# EAGLE design Blinky (EAGLE 8.2.1)
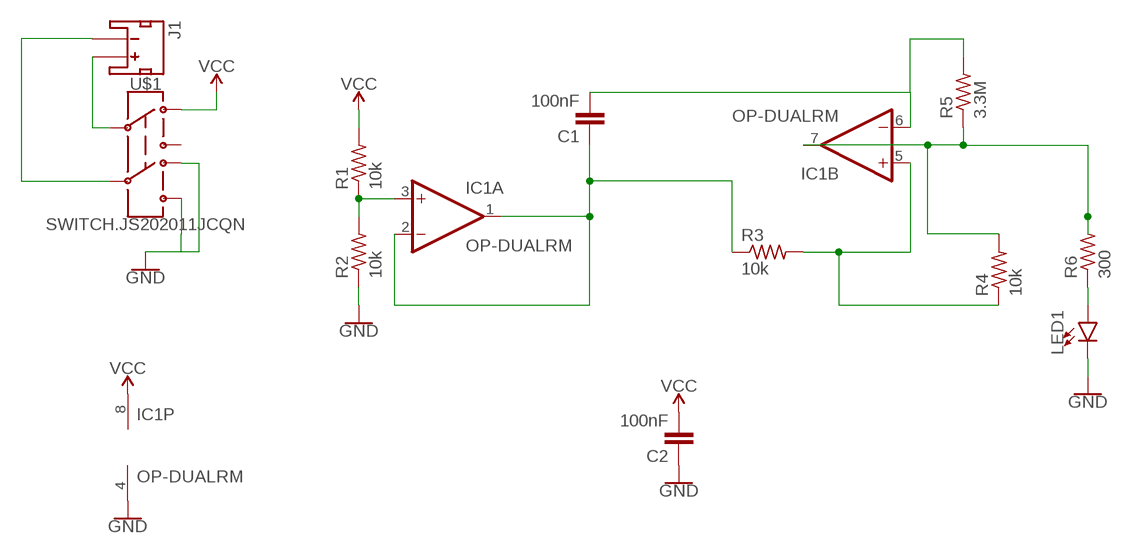
[diagram p0: schematic, sheet 1]

## Parts
C1  100nF  CAPACITOR0402  [C0402]
C2  100nF  CAPACITOR0402  [C0402]
IC1  OP-DUALRM  [MSOP08]
J1  JST_2MM_MALE  [JST-2-SMD]
LED1  LED0603  [LED-0603]
R1  10k  RESISTOR0402  [R0402]
R2  10k  RESISTOR0402  [R0402]
R3  10k  RESISTOR0402  [R0402]
R4  10k  RESISTOR0402  [R0402]
R5  3.3M  RESISTOR0402  [R0402]
R6  300  RESISTOR0402  [R0402]
U$1  SWITCH.JS202011JCQN  [SWITCH.00]

## Nets
GND: C2.1 IC1.4(P:V-) LED1.C R2.1 U$1.5 U$1.7
N$1: J1.1(-) U$1.6
N$2: J1.2(+) U$1.2
N$3: C1.1 IC1.1(A:OUT) IC1.2(A:-IN) R3.1
N$4: IC1.5(B:+IN) R3.2 R4.1
N$5: C1.2 IC1.6(B:-IN) R5.2
N$6: IC1.3(A:+IN) R1.1 R2.2
N$7: IC1.7(B:OUT) R4.2 R5.1 R6.2
N$8: LED1.A R6.1
VCC: C2.2 IC1.8(P:V+) R1.2 U$1.1
Unconnected: J1.NC1(PAD1) J1.NC2(PAD2) U$1.3

## Library data of the parts
C1 C2 = CalvEngIO-Passives:CAPACITOR
IC1 = CalvEngIO-AnalogIC:OP-DUAL: Precision Micropower, Low Noise CMOS, Rail-to-Rail Input/Output Operational Amplifiers Source: http://www.analog.com/static/imported-files/data_sheets/AD8603_8607_8609.pdf; MF: ALTERA CORPORATION; MPN: AD8607ARMZ-REEL; OC_FARNELL: 1464990; OC_NEWARK: 59K6925
J1 = CalvEngIO-Connectors:JST_2MM_MALE: JST 2MM MALE RA CONNECTOR Two pin, compact surface mount connector. Commonly used as a battery input connection point. We really like the solid locking feeling and high current rating on these small connectors. We use these all the time as battery connectors. Mates to single-cell LiPo batteries. Here is the connector we sell at SparkFun: JST Right Angle Connector - White <https://www.sparkfun.com/products/8612> (PRT-08612) Datasheet <http://www.sparkfun.com/datasheets/Prototyping/Connectors/JST-Horizontal.pdf> It was used on these SparkFun products: SparkFun MOSFET Power Controller <https://www.sparkfun.com/products/11214> (PRT-11214) SparkFun Battery Babysitter - LiPo Battery Manager <https://www.sparkfun.com/products/13777> (PRT-13777) And many, many others that required a lipo battery connection.; PROD_ID: CONN-11443; SF_ID: PRT-08612
LED1 = CalvEngIO-LED:LED: LED (Generic) Standard schematic elements and footprints for 5mm, 3mm, 1206, and 0603 sized LEDs. Generic LEDs with no color specified. LTST-C190KGKT: arrow indicates cathode
R1-R6 = CalvEngIO-Passives:RESISTOR
U$1 = CalvEngIO-Switches:SWITCH.JS202011JCQN

## Net classes
0 default: width 0.203 mm, drill 0.508 mm, clearance 0.203 mm

## Board
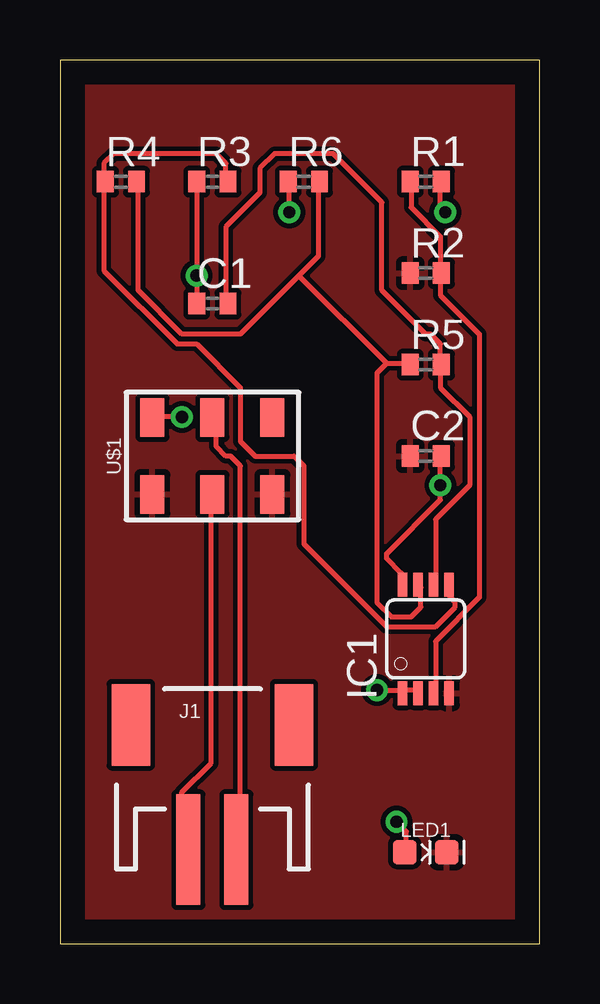
[diagram p1: board, top side]
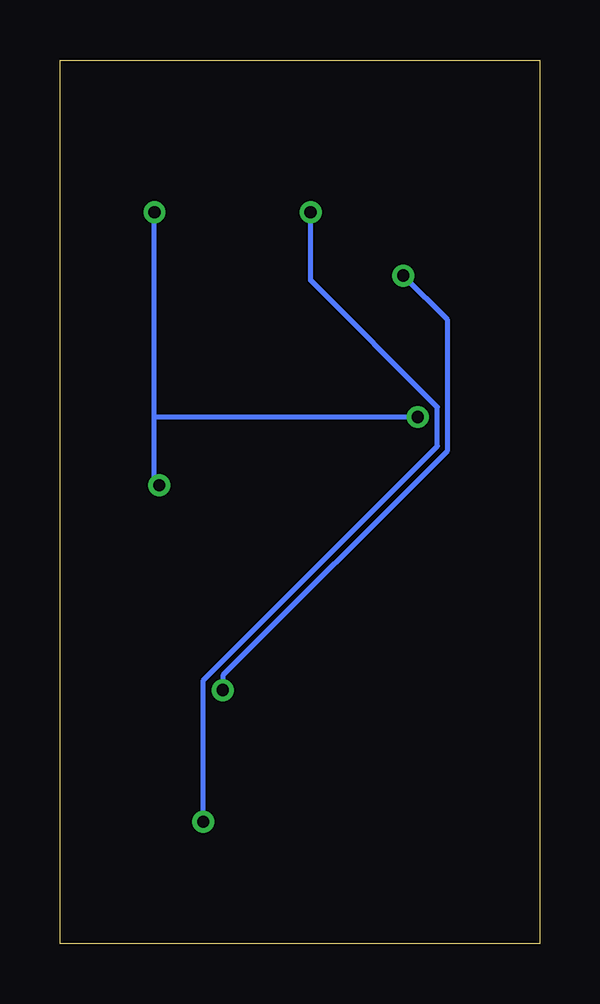
[diagram p2: board, bottom side, seen from below]

Size 19.99 x 36.82 mm. Coordinates in mm from the lower left corner, seen from the top.
Outline: 0,0 19.99,0 19.99,36.82 0,36.82 0,0
Copper layers (1*16): Top 0.035mm / dielectric 1.5mm / Bottom 0.035mm
Design rules "default": minimum track width 6mil, minimum drill 0.35mm, track to track 6mil, track to pad 6mil, pad to pad 6mil, via to via 6mil, smd to smd 6mil, copper to edge 40mil, drill to drill 6mil, minimum pad ring 10mil, minimum via ring 8mil, stop-mask expansion 4mil, vias tented up to drill 0mil, thermal gap 10mil

### Footprints (pad centres in the part's own frame; a part is rotated, then mirrored left to right if it is on the bottom)
C0402 = smd 0.7 x 0.9: 1 -0.65,0; 2 0.65,0
MSOP08 = smd 0.4 x 1: 1 -0.976,-2.263; 2 -0.326,-2.263; 3 0.324,-2.263; 4 0.974,-2.263; 5 0.974,2.262; 6 0.324,2.262; 7 -0.326,2.262; 8 -0.976,2.262
JST-2-SMD = smd 1 x 4.6: 1 -1,-3.7; 2 1,-3.7 | smd 1.6 x 3.4: NC1 -3.4,1.5; NC2 3.4,1.5
LED-0603 = smd 1 x 1: A -0.877,0; C 0.877,0
R0402 = smd 0.7 x 0.9: 1 -0.65,0; 2 0.65,0
SWITCH.00 = smd 1 x 1.6: 1 -2.5,1.6; 2 0,1.6; 3 2.5,1.6; 5 -2.5,-1.6; 6 0,-1.6; 7 2.5,-1.6

### Placement (x,y rotation side)
C1  6.35,26.67 0 top
C2  15.24,20.32 0 top
IC1  15.24,12.7 0 top
J1  6.35,7.62 0 top
LED1  15.24,3.81 0 top
R1  15.24,31.75 0 top
R2  15.24,27.94 0 top
R3  6.35,31.75 0 top
R4  2.54,31.75 0 top
R5  15.24,24.13 0 top
R6  10.16,31.75 0 top
U$1  6.35,20.32 0 top

### Tracks (layer width: path | path; a pad name or v marks a point on that pad's centre or on a via)
GND
  pour Top: -1.27,38.1 21.59,38.1 21.59,-1.27 -1.27,-1.27
N$1
  Top 0.203: U$1.6 6.3,18.69 6.3,7.52 5.08,6.3 5.08,4.27 5.28,4.06 J1.1
N$2
  Top 0.203: U$1.2 6.5,21.74 6.5,20.73 6.91,20.32 7.11,20.32 7.52,19.91 7.52,4.06 J1.2
N$3  (via drill 0.51)
  Top 0.203: IC1.2 14.83,10.57 14.43,10.57 IC1.1 14.22,10.57 v13.21,10.57 | C1.1 5.69,26.82 v5.69,27.84 5.69,31.7 R3.1
  Bottom 0.203: v13.21,10.57 13.21,11.18 3.86,20.52 3.86,26.01 v5.69,27.84
N$4
  Top 0.203: R3.2 6.91,31.9 6.91,32.51 6.5,32.92 2.23,32.92 1.83,32.51 1.83,31.9 R4.1 1.83,31.7 1.83,28.04 4.88,24.99 5.69,24.99 7.52,23.16 7.52,20.93 8.13,20.32 9.75,20.32 10.16,19.91 10.16,16.66 13.61,13.21 15.65,13.21 16.46,14.02 16.46,14.22 16.26,14.43 16.26,14.83 IC1.5
N$5
  Top 0.203: C1.2 6.91,26.82 6.91,29.87 8.33,31.29 8.33,32.31 8.94,32.92 11.38,32.92 13.41,30.89 13.41,27.23 15.24,25.4 15.44,25.4 15.85,24.99 15.85,24.18 R5.2 15.85,23.98 15.85,23.16 17.07,21.95 17.07,19.1 15.65,17.68 15.65,15.04 IC1.6
N$6
  Top 0.203: R1.1 14.63,31.7 14.63,30.68 15.85,29.46 15.85,28.04 R2.2 15.85,27.84 15.85,27.03 17.48,25.4 17.48,14.43 15.65,12.6 15.65,10.57 IC1.3
N$7
  Top 0.203: 9.96,27.84 10.77,28.65 10.77,31.7 R6.2 | 9.96,27.84 7.52,25.4 5.08,25.4 3.25,27.23 3.25,31.7 R4.2 | 13.61,24.18 14.43,24.18 R5.1 | 9.96,27.84 13.61,24.18 | 13.61,24.18 13.21,23.77 13.21,14.22 13.82,13.61 14.63,13.61 15.04,14.02 15.04,14.83 IC1.7
N$8  (via drill 0.51)
  Top 0.203: v9.55,30.48 9.55,31.7 R6.1 | v14.02,5.08 14.43,4.67 14.43,3.86 LED1.A
  Bottom 0.203: v9.55,30.48 9.55,27.64 4.27,22.35 4.27,20.73 14.02,10.97 v14.02,5.08
VCC  (via drill 0.51)
  Top 0.203: C2.2 15.85,20.32 v15.85,19.1 15.85,18.49 13.61,16.26 13.61,16.05 14.22,15.44 14.22,15.04 IC1.8 | v16.05,30.48 15.85,30.68 15.85,31.7 R1.2 | v5.08,21.95 3.86,21.95 U$1.1
  Bottom 0.203: 16.05,21.95 16.05,19.3 v15.85,19.1 | 16.05,21.95 v16.05,30.48 | 16.05,21.95 v5.08,21.95